# Altium schematic sheet ST-Link_V3E.SchDoc: ST-LINK V3E
size A3; Project: STLink V3 Embedded Prototype; BOM Version: A-01; Date: Not used; ApprovedBy: Not used; CheckedBy: Not used; Author: Not used; CompanyName: STMicroelectronics; DrawnBy: Not used; Engineer: Not used; Organization: Not used; Address1: Not used; Address2: Not used; Address3: Not used; Address4: Not used; DocumentNumber: 17; Revision: Not used; SheetNumber: 17; SheetTotal: 17; CurrentTime: Not used; CurrentDate: Not used; Time: Not used; DocumentFullPathAndName: Not used; DocumentName: Not used; ModifiedDate: Not used; ImagePath: Not used; ProjectName: Not used; Application_BuildNumber: Not used
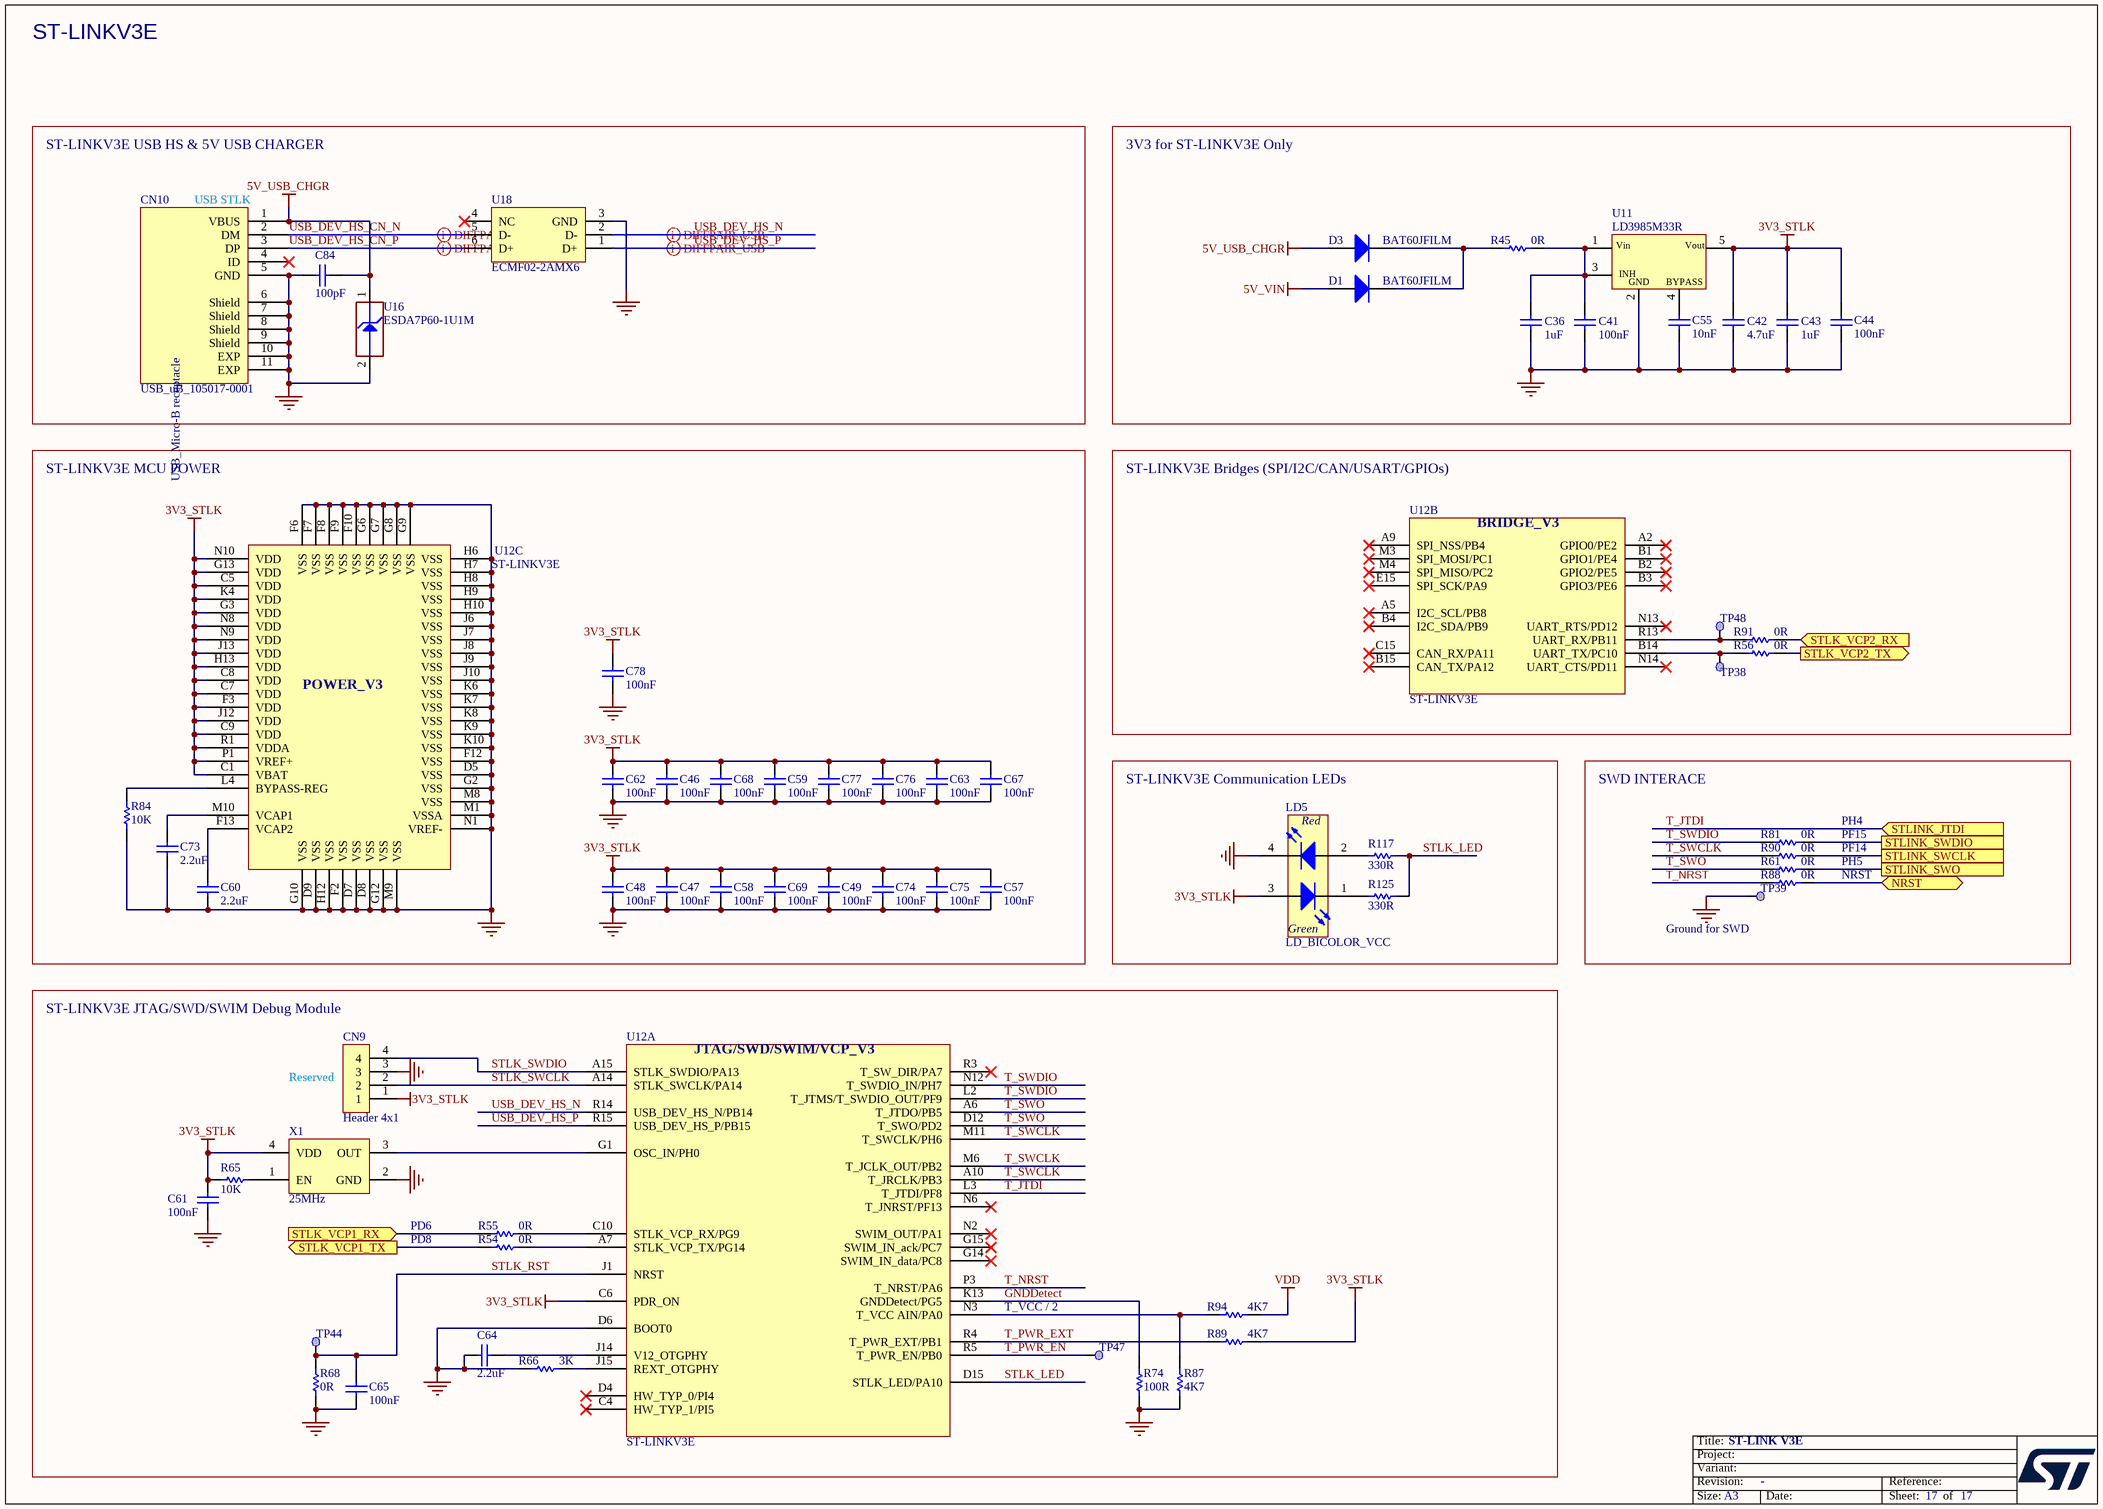
[diagram p0: ST-Link_V3E.SchDoc]

## Parts
C36  value 1uF  [C0402]  (hidden comment: Capacitor)
C41  value 100nF  [C0402]  (hidden comment: Capacitor)
C42  value 4.7uF  [C0402]  (hidden comment: Capacitor)
C43  value 1uF  [C0402]  (hidden comment: Capacitor)
C44  value 100nF  [C0402]  (hidden comment: Capacitor)
C46  value 100nF  [C0402]  (hidden comment: Capacitor)
C47  value 100nF  [C0402]  (hidden comment: Capacitor)
C48  value 100nF  [C0402]  (hidden comment: Capacitor)
C49  value 100nF  [C0402]  (hidden comment: Capacitor)
C55  value 10nF  [C0402]  (hidden comment: Capacitor)
C57  value 100nF  [C0402]  (hidden comment: Capacitor)
C58  value 100nF  [C0402]  (hidden comment: Capacitor)
C59  value 100nF  [C0402]  (hidden comment: Capacitor)
C60  value 2.2uF  [C0201_H0P5]  (hidden comment: Capacitor)
C61  value 100nF  [C0402]  (hidden comment: Capacitor)
C62  value 100nF  [C0402]  (hidden comment: Capacitor)
C63  value 100nF  [C0402]  (hidden comment: Capacitor)
C64  value 2.2uF  [C0201_H0P5]  (hidden comment: Capacitor)
C65  value 100nF  [C0402]  (hidden comment: Capacitor)
C67  value 100nF  [C0402]  (hidden comment: Capacitor)
C68  value 100nF  [C0402]  (hidden comment: Capacitor)
C69  value 100nF  [C0402]  (hidden comment: Capacitor)
C73  value 2.2uF  [C0201_H0P5]  (hidden comment: Capacitor)
C74  value 100nF  [C0402]  (hidden comment: Capacitor)
C75  value 100nF  [C0402]  (hidden comment: Capacitor)
C76  value 100nF  [C0402]  (hidden comment: Capacitor)
C77  value 100nF  [C0402]  (hidden comment: Capacitor)
C78  value 100nF  [C0402]  (hidden comment: Capacitor)
C84  value 100pF  [C0402]  (hidden comment: Capacitor)
CN9  Header 4x1  [CON_SAMTEC_TSW-104-07-G-S]
CN10  value USB_uB_105017-0001  [CON_USBMICROB_MOLEX_105017-0001_H2P90]  (hidden comment: USB_uB_105017.0001)
D1  BAT60JFILM  [DIO_SOD323]
D3  BAT60JFILM  [DIO_SOD323]
LD5  LD_BICOLOR_VCC  [LED_BI-GR_CMD67-22]
R45  value 0R  [R0402]  (hidden comment: Resistor)
R54  value 0R  [R0402]  (hidden comment: Resistor)
R55  value 0R  [R0402]  (hidden comment: Resistor)
R56  value 0R  [R0402]  (hidden comment: Resistor)
R61  value 0R  [R0402]  (hidden comment: Resistor)
R65  value 10K  [R0402]  (hidden comment: Resistor)
R66  value 3K  [R0402]  (hidden comment: Resistor)
R68  value 0R  [R0402]  (hidden comment: Resistor)
R74  value 100R  [R0402]  (hidden comment: Resistor)
R81  value 0R  [R0402]  (hidden comment: Resistor)
R84  value 10K  [R0402]  (hidden comment: Resistor)
R87  value 4K7  [R0402]  (hidden comment: Resistor)
R88  value 0R  [R0402]  (hidden comment: Resistor)
R89  value 4K7  [R0402]  (hidden comment: Resistor)
R90  value 0R  [R0402]  (hidden comment: Resistor)
R91  value 0R  [R0402]  (hidden comment: Resistor)
R94  value 4K7  [R0402]  (hidden comment: Resistor)
R117  value 330R  [R0402]  (hidden comment: Resistor)
R125  value 330R  [R0402]  (hidden comment: Resistor)
TP38  Test Point  [TP_SMD_1MM]  (value not drawn)  (no BOM)
TP39  Test Point  [TP_SMD_1MM]  (value not drawn)  (no BOM)
TP44  Test Point  [TP_SMD_1MM]  (value not drawn)  (no BOM)
TP47  Test Point  [TP_SMD_1MM]  (value not drawn)  (no BOM)
TP48  Test Point  [TP_SMD_1MM]  (value not drawn)  (no BOM)
U11  LD3985M33R  [REG_SOT23-5L]
U12  ST-LINKV3E  [ICC_UFBGA201_176+25_10X10_P065]  (parts A,B,C of 3)
U16  value ESDA7P60-1U1M  [ESD_QFN2_1P6X1_P125]  (hidden comment: ESD-TRANSIL)
U18  ECMF02-2AMX6  [ESD_QFN-6L_1P7X1P5_P050]
X1  value 25MHz  [OSC_NDK_NZ2520SB_4P]  (hidden comment: OSCILLATOR_4_PINS)

## Blocks framed on the sheet
ST-LINKV3E USB HS & 5V USB CHARGER: C84 CN10 U16 U18
3V3 for ST-LINKV3E Only: C36 C41-C44 C55 D1 D3 R45 U11
ST-LINKV3E MCU POWER: C46-C49 C57-C60 C62 C63 C67-C69 C73-C78 R84 U12
ST-LINKV3E Bridges (SPI/I2C/CAN/USART/GPIOs): R56 R91 TP38 TP48 U12
ST-LINKV3E Communication LEDs: LD5 R117 R125
SWD INTERACE: R61 R81 R88 R90 TP39
ST-LINKV3E JTAG/SWD/SWIM Debug Module: C61 C64 C65 CN9 R54 R55 R65 R66 R68 R74 R87 R89 R94 TP44 TP47 U12 X1

## Ports
NRST (bidir), STLINK_JTDI (in), STLINK_SWCLK, STLINK_SWDIO, STLINK_SWO, STLK_VCP1_RX (in), STLK_VCP1_TX (out), STLK_VCP2_RX (in), STLK_VCP2_TX (out)

## Nets
3V3_STLK: C42.2 C43.2 C44.2 C46.2 C47.2 C48.2 C49.2 C57.2 C58.2 C59.2 C61.2 C62.2 C63.2 C67.2 C68.2 C69.2 C74.2 C75.2 C76.2 C77.2 C78.2 CN9.1 LD5.3(YellowGreen_anode) R65.1 R89.1 U11.5(Vout) U12.C1(VBAT) U12.C5(VDD) U12.C6(PDR_ON) U12.C7(VDD) U12.C8(VDD) U12.C9(VDD) U12.F3(VDD) U12.G3(VDD) U12.G13(VDD) U12.H13(VDD) U12.J12(VDD) U12.J13(VDD) U12.K4(VDD) U12.N8(VDD) U12.N9(VDD) U12.N10(VDD) U12.P1(VREF+) U12.R1(VDDA) X1.4(VDD)
5V_USB_CHGR: C84.2 CN10.1(VBUS) D3.1(A) U16.1(IO1)
5V_VIN: D1.1(A)
GND: C36.2 C41.1 C42.1 C43.1 C44.1 C46.1 C47.1 C48.1 C49.1 C55.1 C57.1 C58.1 C59.1 C60.1 C61.1 C62.1 C63.1 C64.1 C65.1 C67.1 C68.1 C69.1 C73.1 C74.1 C75.1 C76.1 C77.1 C78.1 C84.1 CN9.3 CN10.5(GND) CN10.6(Shield) CN10.7(Shield) CN10.8(Shield) CN10.9(Shield) CN10.10(EXP) CN10.11(EXP) LD5.4(RED_cathode) R66.1 R68.2 R74.1 R84.1 R87.1 TP39.1 U11.2(GND) U12.D5(VSS) U12.D6(BOOT0) U12.D7(VSS) U12.D8(VSS) U12.D9(VSS) U12.F2(VSS) U12.F6(VSS) U12.F7(VSS) U12.F8(VSS) U12.F9(VSS) U12.F10(VSS) U12.F12(VSS) U12.G2(VSS) U12.G6(VSS) U12.G7(VSS) U12.G8(VSS) U12.G9(VSS) U12.G10(VSS) U12.G12(VSS) U12.H6(VSS) U12.H7(VSS) U12.H8(VSS) U12.H9(VSS) U12.H10(VSS) U12.H12(VSS) U12.J6(VSS) U12.J7(VSS) U12.J8(VSS) U12.J9(VSS) U12.J10(VSS) U12.K6(VSS) U12.K7(VSS) U12.K8(VSS) U12.K9(VSS) U12.K10(VSS) U12.M1(VSSA) U12.M8(VSS) U12.M9(VSS) U12.N1(VREF-) U16.2(GND) U18.3(GND) X1.2(GND)
VDD: R94.2
GNDDetect: R74.2 U12.K13(GNDDetect/PG5)
NRST: R88.2 ; port NRST
STLINK_SWCLK: R90.2 ; port STLINK_SWCLK
STLINK_SWDIO: R81.2 ; port STLINK_SWDIO
STLINK_SWO: R61.2 ; port STLINK_SWO
STLK_LED: R117.2 R125.2 U12.D15(STLK_LED/PA10)
STLK_RST: C65.2 R68.1 TP44.1 U12.J1(NRST)
STLK_SWCLK: CN9.2 U12.A14(STLK_SWCLK/PA14)
STLK_SWDIO: CN9.4 U12.A15(STLK_SWDIO/PA13)
STLK_VCP1_RX: R55.2 ; port STLK_VCP1_RX
STLK_VCP1_TX: R54.2 ; port STLK_VCP1_TX
STLK_VCP2_RX: R91.1 ; port STLK_VCP2_RX
STLK_VCP2_TX: R56.1 ; port STLK_VCP2_TX
T_JTDI: U12.L3(T_JTDI/PF8) ; port STLINK_JTDI
T_NRST: R88.1 U12.P3(T_NRST/PA6)
T_PWR_EN: TP47.1 U12.R5(T_PWR_EN/PB0)
T_PWR_EXT: R89.2 U12.R4(T_PWR_EXT/PB1)
T_SWCLK: R90.1 U12.A10(T_JRCLK/PB3) U12.M6(T_JCLK_OUT/PB2) U12.M11(T_SWCLK/PH6)
T_SWDIO: R81.1 U12.L2(T_JTMS/T_SWDIO_OUT/PF9) U12.N12(T_SWDIO_IN/PH7)
T_SWO: R61.1 U12.A6(T_JTDO/PB5) U12.D12(T_SWO/PD2)
USB_DEV_HS_CN_N: CN10.2(DM) U18.5(D-)
USB_DEV_HS_CN_P: CN10.3(DP) U18.6(D+)
USB_DEV_HS_N: U12.R14(USB_DEV_HS_N/PB14) U18.2(D-)
USB_DEV_HS_P: U12.R15(USB_DEV_HS_P/PB15) U18.1(D+)
NetC36_1: C36.1 C41.2 R45.2 U11.1(Vin) U11.3(CE)
NetC55_2: C55.2 U11.4(BYPASS)
NetC60_2: C60.2 U12.F13(VCAP2)
NetC64_2: C64.2 U12.J14(V12_OTGPHY)
NetC73_2: C73.2 U12.M10(VCAP1)
NetD1_2: D1.2(K) D3.2(K) R45.1
NetLD5_1: LD5.1(YellowGreen_cathode) R125.1
NetLD5_2: LD5.2(Red_anode) R117.1
NetR54_1: R54.1 U12.A7(STLK_VCP_TX/PG14)
NetR55_1: R55.1 U12.C10(STLK_VCP_RX/PG9)
NetR56_2: R56.2 TP38.1 U12.B14(UART_TX/PC10)
NetR65_2: R65.2 X1.1(EN)
NetR66_2: R66.2 U12.J15(REXT_OTGPHY)
NetR84_2: R84.2 U12.L4(BYPASS-REG)
NetR87_2: R87.2 R94.1 U12.N3(T_VCC_AIN/PA0)
NetR91_2: R91.2 TP48.1 U12.R13(UART_RX/PB11)
NetU12_G1: U12.G1(OSC_IN/PH0) X1.3(OUT)

Not connected (* = marked no-connect by the designer): CN10 4(ID)*; U12 A2(GPIO0/PE2)* A5(I2C_SCL/PB8)* A9(SPI_NSS/PB4)* B1(GPIO1/PE4)* B2(GPIO2/PE5)* B3(GPIO3/PE6)* B4(I2C_SDA/PB9)* B15(CAN_TX/PA12)* C4(HW_TYP_1/PI5)* C15(CAN_RX/PA11)* D4(HW_TYP_0/PI4)* E15(SPI_SCK/PA9)* G14(SWIM_IN_data/PC8)* G15(SWIM_IN_ack/PC7)* M3(SPI_MOSI/PC1)* M4(SPI_MISO/PC2)* N2(SWIM_OUT/PA1)* N6(T_JNRST/PF13)* N13(UART_RTS/PD12)* N14(UART_CTS/PD11)* R3(T_SW_DIR/PA7)*; U18 4(NC)*

## Layout directives
differential pair; rule Impedance Constraint [Min = 85.00    Max = 95.00    ]: USB_DEV_HS_CN_N, USB_DEV_HS_CN_P, USB_DEV_HS_N, USB_DEV_HS_P

## Notes on the sheet
- ST-LINKV3E
- (near CN10) USB STLK
- PF14
- PF15
- PH4
- NRST
- PH5
- Ground for SWD
- (near CN9) Reserved
- PD8
- PD6
- T_VCC / 2
- Title:
- Project:
- Size:
- Revision:
- Variant:
- A3
- -
- Date:
- Reference:
- Sheet:
- of
- (in symbol MCD-00028) USB_Micro-B receptacle
- (in symbol MCD-00086) INH
- (in symbol MCD-01523, part A) JTAG/SWD/SWIM/VCP_V3
- (in symbol MCD-01523, part B) BRIDGE_V3
- (in symbol MCD-01523, part C) POWER_V3
- (in symbol MCD-02629) Red; Green

## Library data of the parts
C36 C43 = MCD-00095: Capacitor, MLCC, 1uF, 25V, X5R, +/-10%, 0402, T=0.5mm; Manufacturer_Part_Number: GRM155R61E105KA12; Manufacturer: MURATA; Part_Preference: Recommended; Order_Code_RS: 846-7287; Component_Country_Of_Origin: Japan; ShowFields: YES; ID: 2772; Internal_Part_Number: MCD-00095; Status: Released; Part_Type: Capacitor; Package: 0402; ComponentLink1URL: http://tunmcdsvn.tun.st.com/Component_Documentation_Library/Trunk/Capacitor/MURATA_GRM_Series; Order_Code_Digikey: 490-10017-1-ND; Order_Code_Farnell: 2218855
C41 C44 C46-C49 C57-C59 C61-C63 C67-C69 C74-C78 = MCD-00006: Capacitor, MLCC, 100nF, 16V, X7R, +/-10%, 0402, T=0.5mm; Manufacturer_Part_Number: CC0402KRX7R7BB104; Manufacturer: YAGEO; Part_Preference: Recommended; Order_Code_RS: 616-9701; Component_Country_Of_Origin: China; ShowFields: YES; ID: 2474; Internal_Part_Number: MCD-00006; Status: Released; Package: 0402; Part_Type: Capacitor; ComponentLink1URL: http://tunmcdsvn.tun.st.com/Component_Documentation_Library/Trunk/Capacitor/YAGEO_X7R_Series; Order_Code_Digikey: 311-1338-1-ND; Order_Code_Farnell: 9402047
C42 = MCD-01356: Capacitor, MLCC, 4.7uF, 6V3, X5R, +/-20%, 0402, T=0.5mm; Manufacturer_Part_Number: GRM155R60J475ME47; Manufacturer: MURATA; Part_Preference: Recommended; Order_Code_RS: 814-5230; Component_Country_Of_Origin: Japan; ShowFields: YES; ID: 3456; Internal_Part_Number: MCD-01356; Status: Released; Part_Type: Capacitor; Package: 0402; ComponentLink1URL: http://tunmcdsvn.tun.st.com/Component_Documentation_Library/Trunk/Capacitor/MURATA_GRM_Series; Order_Code_Digikey: 490-5915-1-ND; Order_Code_Farnell: 2666407
C55 = MCD-02198: Capacitor, MLCC, 10nF, 50V, X7R, +/-10%, 0402, T=0.5mm; Manufacturer_Part_Number: CC0402KRX7R9BB103; Manufacturer: YAGEO; Part_Preference: Recommended; Order_Code_RS: 6169644; Component_Country_Of_Origin: China; ShowFields: YES; ID: 4298; Internal_Part_Number: MCD-02198; Status: Checked; Part_Type: Capacitor; Package: 0402; ComponentLink1URL: http://tunmcdsvn.tun.st.com/Component_Documentation_Library/Trunk/Capacitor/YAGEO_X7R_Series; Order_Code_Digikey: N/A; Order_Code_Farnell: N/A
C60 C64 C73 = MCD-02235: Capacitor, MLCC, 2.2uF, 10V, X5R,+/-10%, 0201, T=0.5mm; Manufacturer_Part_Number: GRM033R61A225KE47D; Manufacturer: MURATA; Part_Preference: Recommended; Order_Code_RS: NA; Component_Country_Of_Origin: Japan; ShowFields: YES; ID: 4335; Internal_Part_Number: MCD-02235; Status: Checked; Part_Type: Capacitor; Package: 0201; ComponentLink1URL: http://tunmcdsvn.tun.st.com/Component_Documentation_Library/Trunk/Capacitor/MURATA_GRM_Series; Order_Code_Digikey: 490-13227-1-ND; Order_Code_Farnell: NA
C65 = MCD-00006: Capacitor, MLCC, 100nF, 16V, X7R, +/-10%, 0402, T=0.5mm; Part_Preference: Recommended; Manufacturer: YAGEO; Manufacturer_Part_Number: CC0402KRX7R7BB104; Order_Code_RS: 616-9701; Component_Country_Of_Origin: China; ShowFields: YES; ID: 2474; Internal_Part_Number: MCD-00006; Status: Released; Part_Type: Capacitor; Package: 0402; ComponentLink1URL: http://tunmcdsvn.tun.st.com/Component_Documentation_Library/Trunk/Capacitor/YAGEO_X7R_Series; Order_Code_Digikey: 311-1338-1-ND; Order_Code_Farnell: 9402047
C84 = MCD-00205: Capacitor, MLCC, 100pF, 50V, NPO, +/-5%, 0402, T=0.5mm; Manufacturer_Part_Number: CC0402JRNPO9BN101; Manufacturer: YAGEO; Part_Preference: Recommended; Component_Country_Of_Origin: China; ShowFields: YES; ID: 2658; Internal_Part_Number: MCD-00205; Status: Released; Part_Type: Capacitor; Package: 0402; ComponentLink1URL: http://tunmcdsvn.tun.st.com/Component_Documentation_Library/Trunk/Capacitor/YAGEO_NP0_Series; Order_Code_Digikey: 311-1024-1-ND; Order_Code_Farnell: 3019226RL; Order_Code_RS: N/A
CN9 = MCD-00029: Header, 4x1, 2.54mm, VR, TH, T=5.84mm/2.54mm; Part_Type: Connector; Manufacturer_Part_Number: TSW-104-07-G-S; Manufacturer: SAMTEC; Part_Preference: Recommended; Order_Code_RS: 161-2261; Component_Country_Of_Origin: China, Costa Rica, Malaysia, United States, Vietnam; ShowFields: YES; ID: 2487; Internal_Part_Number: MCD-00029; Value: Header 4x1; Status: Released; ComponentLink1URL: http://tunmcdsvn.tun.st.com/Component_Documentation_Library/Trunk/Connector/SAMTEC_TSW_Series/; Order_Code_Digikey: TSW-104-07-G-S-ND; Order_Code_Farnell: 2667450
CN10 = MCD-00028: MicroUSB_TypeB, 5pins, 0.65mm, RA, SMD, T=2.9mm; Manufacturer_Part_Number: 1050170001; Manufacturer: MOLEX; Part_Type: Connector; Part_Preference: Recommended; Order_Code_RS: 848-6764; Component_Country_Of_Origin: Unknown; ShowFields: YES; ID: 2489; Internal_Part_Number: MCD-00028; Status: Released; ComponentLink1URL: http://tunmcdsvn.tun.st.com/Component_Documentation_Library/Trunk/Connector/MOLEX_1050170001/; Order_Code_Digikey: WM1399TR-ND; Order_Code_Farnell: 2293836
D1 D3 = MCD-00034: Manufacturer: STMICROELECTRONICS; Part_Type: Diode; BMS_Part_Number: 9151097; Part_Preference: Recommended; Manufacturer_HQ_COO: EU; Component_Country_Of_Origin: China; ShowFields: YES; ID: 2483; Internal_Part_Number: MCD-00034; Value: BAT60JFILM; Manufacturer_Part_Number: BAT60JFILM; Status: Released; ComponentLink1URL: http://tunmcdsvn.tun.st.com/Component_Datasheet_Library/Trunk/Diodes/STM_Diode_BAT60JFILM-SOD323
LD5 = MCD-02629: LED Bicolor, Green, Red, 4-PLCC; Part_Type: Display; Manufacturer_Part_Number: CMD6722VRVGCTR8; Manufacturer: VISUAL COMMUNICATIONS COMPANY - VCC; Part_Preference: Not recommended; ShowFields: YES; ID: 4735; Internal_Part_Number: MCD-02629; Value: LD_BICOLOR_VCC; Status: Standby; ComponentLink1URL: http://tunmcdsvn.tun.st.com/Component_Documentation_Library/Trunk/Display/VCC_CMD67-22 _Series/; Package: 4-PLCC; Order_Code_Digikey: L628015TR-ND; Order_Code_Farnell: N/A; Order_Code_RS: N/A
R45 R61 R81 R88 R90 = MCD-00052: Resistor, 0R, 0402, +/-5%, 1/16W; Part_Preference: Recommended; Manufacturer: YAGEO; Manufacturer_Part_Number: RC0402JR-070RL; Order_Code_RS: 618-5804; Component_Country_Of_Origin: China; ShowFields: YES; ID: 2540; Internal_Part_Number: MCD-00052; Status: Released; Part_Type: Resistor; Package: 0402; ComponentLink1URL: http://tunmcdsvn.tun.st.com/Component_Documentation_Library/Trunk/Resistor/YAGEO_RC_L_Series; Order_Code_Digikey: 311-0.0JRCT-ND; Order_Code_Farnell: 9232516RL
R54-R56 R68 R91 = MCD-00052: Resistor, 0R, 0402, +/-5%, 1/16W; Manufacturer_Part_Number: RC0402JR-070RL; Manufacturer: YAGEO; Part_Preference: Recommended; Order_Code_RS: 618-5804; Component_Country_Of_Origin: China; ShowFields: YES; ID: 2540; Internal_Part_Number: MCD-00052; Status: Released; Part_Type: Resistor; ComponentLink1URL: http://tunmcdsvn.tun.st.com/Component_Documentation_Library/Trunk/Resistor/YAGEO_RC_L_Series; Package: 0402; Order_Code_Digikey: 311-0.0JRCT-ND; Order_Code_Farnell: 9232516RL
R65 R84 = MCD-00053: Resistor, 10K, 0402, +/-1%, 1/16W; Manufacturer_Part_Number: RC0402FR-0710KL; Manufacturer: YAGEO; BMS_Part_Number: 9131590; Part_Preference: Recommended; Component_Country_Of_Origin: China; ShowFields: YES; ID: 2539; Internal_Part_Number: MCD-00053; Status: Released; Part_Type: Resistor; Package: 0402; ComponentLink1URL: http://tunmcdsvn.tun.st.com/Component_Documentation_Library/Trunk/Resistor/YAGEO_RC_L_Series; Order_Code_Digikey: 311-10.0KLRCT-ND; Order_Code_Farnell: 9239359; Order_Code_RS: N/A
R66 = MCD-00185: Resistor, 3K, 0402, +/-1%, 1/16W; Manufacturer_Part_Number: RC0402FR-073KL; Manufacturer: YAGEO; Part_Preference: Recommended; Component_Country_Of_Origin: China; ShowFields: YES; ID: 2682; Internal_Part_Number: MCD-00185; Status: Released; Part_Type: Resistor; Package: 0402; ComponentLink1URL: http://tunmcdsvn.tun.st.com/Component_Documentation_Library/Trunk/Resistor/YAGEO_RC_L_Series; Order_Code_Digikey: 311-3KLRCT-ND; Order_Code_Farnell: 1458777; Order_Code_RS: N/A
R74 = MCD-00067: Resistor, 100R, 0402, +/- 1%, 1/16W; Manufacturer_Part_Number: RC0402FR-07100RL; Manufacturer: YAGEO; Part_Preference: Recommended; Component_Country_Of_Origin: China; ShowFields: YES; ID: 2527; Internal_Part_Number: MCD-00067; Status: Released; Part_Type: Resistor; Package: 0402; ComponentLink1URL: http://tunmcdsvn.tun.st.com/Component_Documentation_Library/Trunk/Resistor/YAGEO_RC_L_Series; Order_Code_Digikey: 311-100LRCT-ND; Order_Code_Farnell: 9239111; Order_Code_RS: N/A
R87 R89 R94 = MCD-00065: Resistor, 4K7, 0402, +/-1%, 1/16W; Manufacturer_Part_Number: RC0402FR-074K7L; Manufacturer: YAGEO; Part_Preference: Recommended; Component_Country_Of_Origin: China; ShowFields: YES; ID: 2526; Internal_Part_Number: MCD-00065; Status: Released; Part_Type: Resistor; Package: 0402; ComponentLink1URL: http://tunmcdsvn.tun.st.com/Component_Documentation_Library/Trunk/Resistor/YAGEO_RC_L_Series; Order_Code_Digikey: 311-4.7KLRCT-ND; Order_Code_Farnell: 9239316; Order_Code_RS: N/A
R117 R125 = MCD-00062: Resistor, 330R, 0402, +/-1%, 1/16W; Manufacturer_Part_Number: RC0402FR-07330RL; Manufacturer: YAGEO; Part_Preference: Recommended; Component_Country_Of_Origin: China; ShowFields: YES; ID: 2529; Internal_Part_Number: MCD-00062; Status: Released; Part_Type: Resistor; Package: 0402; ComponentLink1URL: http://tunmcdsvn.tun.st.com/Component_Documentation_Library/Trunk/Resistor/YAGEO_RC_L_Series; Order_Code_Digikey: 311-330LRCT-ND; Order_Code_Farnell: 9239170; Order_Code_RS: N/A
TP38 TP39 TP44 TP47 TP48 = MCD-00074: Test Point 1mm; Part_Type: Misc; Part_Preference: Recommended; ShowFields: YES; ID: 2518; Internal_Part_Number: MCD-00074; Status: Released; Manufacturer_Part_Number: N/A; Manufacturer: N/A; ComponentLink1URL: http://na; Order_Code_Digikey: N/A; Order_Code_Farnell: N/A; Order_Code_RS: N/A
U11 = MCD-00086: Ultra low drop-low noise BiCMOS voltage, regulators low ESR capacitors compatible; BMS_Part_Number: 9176161; Part_Preference: Recommended; Part_Type: IC; Manufacturer: STMICROELECTRONICS; Manufacturer_HQ_COO: EU; Component_Country_Of_Origin: China; ShowFields: YES; ID: 2506; Internal_Part_Number: MCD-00086; Value: LD3985M33R; Status: Released; Manufacturer_Part_Number: LD3985M33R; ComponentLink1URL: http://tunmcdsvn.tun.st.com/Component_Datasheet_Library/Trunk/IC/STM_LDO_LD3985
U12 = MCD-01523: MCU, Arm Cortex-M7 32-bit MCU, 512KB Flash, 276KB RAM, With Crypto; Part_Type: IC; Manufacturer_Part_Number: STM32F723IEK6; Manufacturer: STMICROELECTRONICS; Part_Preference: Recommended; Manufacturer_HQ_COO: EU; Value: ST-LINKV3S; Component_Country_Of_Origin: Philippines; ShowFields: YES; ID: 3623; Internal_Part_Number: MCD-01523; Package: ICC_UFBGA201_176+25_10X10_P065; ComponentLink1URL: http://tunmcdsvn.tun.st.com/Component_Datasheet_Library/Trunk/IC/BGA176+25L_10x10x0.6_pitch0.65.pdf
U16 = MCD-00251: High power transient voltage suppressor, 7V breakdown; Part_Type: Diode; Manufacturer: STMICROELECTRONICS; BMS_Part_Number: 9179042; Part_Preference: Recommended; Manufacturer_HQ_COO: EU; Component_Country_Of_Origin: China; ShowFields: YES; ID: 2618; Internal_Part_Number: MCD-00251; Status: Released; Manufacturer_Part_Number: ESDA7P60-1U1M; ComponentLink1URL: http://tunmcdsvn.tun.st.com/Component_Datasheet_Library/Trunk/Diodes/STM_ESD_ESDA7P60-1U1M
U18 = MCD-00649: Common mode filter with ESD protection for USB 2.0 interface; Part_Type: Diode; Manufacturer: STMICROELECTRONICS; BMS_Part_Number: 9151138; Part_Preference: Recommended; Manufacturer_HQ_COO: EU; Component_Country_Of_Origin: China; ShowFields: YES; ID: 3094; Internal_Part_Number: MCD-00649; Value: ECMF02-2AMX6; Status: Released; Manufacturer_Part_Number: ECMF02-2AMX6; ComponentLink1URL: http://tunmcdsvn.tun.st.com/Component_Datasheet_Library/Trunk/Diodes/STM_ESD_ECMF02-2AMX6
X1 = MCD-00597: Oscillator, SPXO, 25Mhz, +/-50ppm, 3V3, square wave, 2.5x2mm; Manufacturer_Part_Number: NZ2520SH-25MHZ-END4869C; Manufacturer: NDK; Part_Type: Crystal_Osc; BMS_Part_Number: 9157050; Part_Preference: Recommended; Component_Country_Of_Origin: Unknown; ShowFields: YES; ID: 3148; Internal_Part_Number: MCD-00597; Status: Released; ComponentLink1URL: http://tunmcdsvn.tun.st.com/Component_Documentation_Library/Trunk/Crytal_Oscillator/NDK_NZ2520SH_Series; Package: 2.5x2mm; Order_Code_Digikey: N/A; Order_Code_Farnell: N/A; Order_Code_RS: N/A